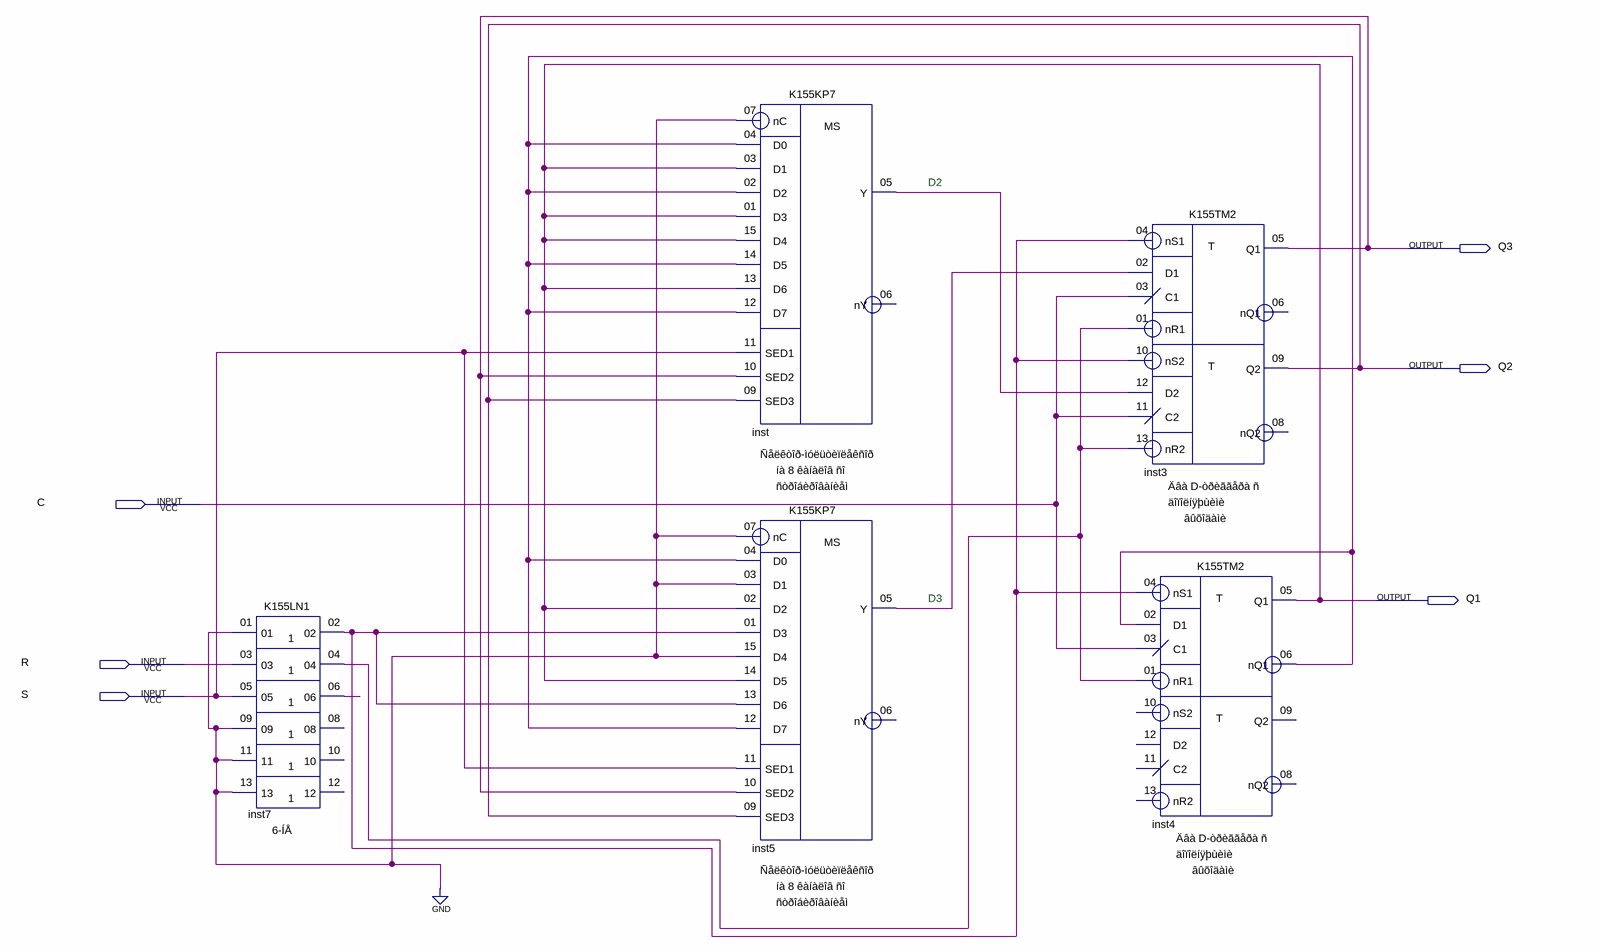
[diagram p0: schematic sheet]
// Quartus schematic lab1.bdf as structural Verilog: 5 symbols, 6 pins
module lab1 (
  input  C,
  input  R,
  input  S,
  output Q3,
  output Q2,
  output Q1
);

  wire inst4_nq1, inst5_y, inst7_02, inst7_04, inst7_06, inst_y;

  K155LN1 inst7 (
    .\01 (1'b0), .\03 (R), .\05 (S), .\09 (1'b0), .\11 (1'b0), .\13 (1'b0), .\02 (inst7_02), .\04 (inst7_04),
    .\06 (inst7_06));  // open: 08, 10, 12
  K155KP7 inst (
    .nC(1'b0), .D0(inst4_nq1), .D1(Q1), .D2(inst4_nq1), .D3(Q1), .D4(Q1), .D5(inst4_nq1), .D6(Q1),
    .D7(inst4_nq1), .SED1(S), .SED2(Q3), .SED3(Q2), .Y(inst_y));  // open: nY
  K155KP7 inst5 (
    .nC(1'b0), .D0(inst4_nq1), .D1(1'b0), .D2(Q1), .D3(inst7_02), .D4(1'b0), .D5(Q1), .D6(inst7_02),
    .D7(inst4_nq1), .SED1(S), .SED2(Q3), .SED3(Q2), .Y(inst5_y));  // open: nY
  K155TM2 inst3 (
    .nS1(inst7_02), .nR1(inst7_04), .C1(C), .D1(inst5_y), .nS2(inst7_02), .nR2(inst7_04), .C2(C),
    .D2(inst_y), .Q1(Q3), .Q2(Q2));  // open: nQ1, nQ2
  K155TM2 inst4 (
    .nS1(inst7_02), .nR1(inst7_04), .C1(C), .D1(inst4_nq1), .Q1(Q1), .nQ1(inst4_nq1));  // open: nS2, nR2, C2, D2, Q2, nQ2

  // Notes on the sheet:
  //   D2
  //   D3
endmodule
